# Altium schematic sheet LMP91000 & NO2 Sensor.SchDoc
size A
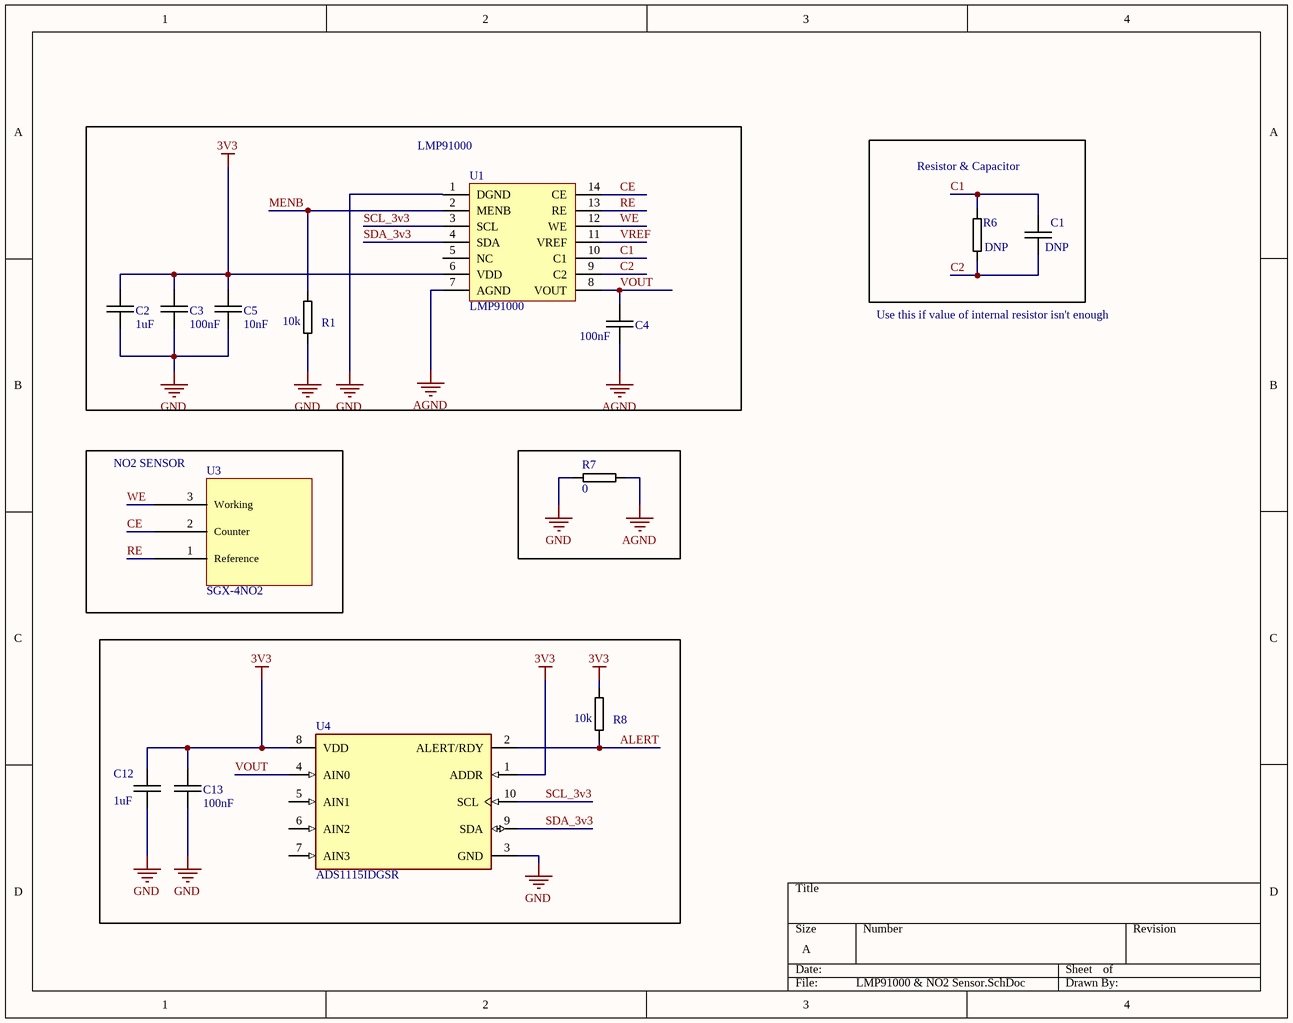
[diagram p0: LMP91000 & NO2 Sensor.SchDoc]

## Parts
C1  DNP  [0603C]
C2  1uF  [0603C]
C3  100nF  [0603C]
C4  100nF  [0603C]
C5  10nF  [0603C]
C12  1uF  [0603C]
C13  100nF  [0603C]
R1  10k  [0603R]
R6  DNP  [0603R]
R7  0  [0603R]
R8  10k  [0603R]
U1  LMP91000  [LMP91000]
U3  SGX-4NO2  [SGX-4NO2]
U4  ADS1115IDGSR  [FP-DGS0010A-MFG]

## Blocks framed on the sheet
LMP91000: C2-C5 R1 U1
Resistor & Capacitor: C1 R6
NO2 SENSOR: U3

## Nets
3V3: C2.1 C3.1 C5.1 C12.2 C13.2 R8.2 U1.6(VDD) U4.1(ADDR) U4.8(VDD)
AGND: C4.1 R7.1 U1.7(AGND)
GND: C2.2 C3.2 C5.2 C12.1 C13.1 R1.1 R7.2 U1.1(DGND) U4.3(GND)
ALERT: R8.1 U4.2(ALERT/RDY)
C1: C1.2 R6.2 U1.10(C1)
C2: C1.1 R6.1 U1.9(C2)
CE: U1.14(CE) U3.2(Counter)
MENB: R1.2 U1.2(MENB)
RE: U1.13(RE) U3.1(Reference)
SCL_3v3: U1.3(SCL) U4.10(SCL)
SDA_3v3: U1.4(SDA) U4.9(SDA)
VOUT: C4.2 U1.8(VOUT) U4.4(AIN0)
VREF: U1.11(VREF)
WE: U1.12(WE) U3.3(Working)

Not connected (* = marked no-connect by the designer): U1 5(NC); U4 5(AIN1) 6(AIN2) 7(AIN3)

## Notes on the sheet
- Use this if value of internal resistor isn't enough

## Library data of the parts
C1-C5 C12 C13 = 0603C
R1 R6-R8 = 0603R
U1 = LMP91000: The LMP91000 is a programmable analog front-end(AFE) for use in micro-power electrochemical sensing applications.
U3 = SGX-4NO2: Amphenol SGX Sensortech SGX-4x Electrochemical Sensors are the industrial and commercial gas sensing products.
U4 = CMP-0003-00385-3: IC ADC 16BIT SIGMA-DELTA 10VSSOP; Max Supply Voltage (DC): 5.5V; Resolution: 16b; Interface: I2C; Number of Inputs: 4; Sampling Rate: 860S/s; Integral Nonlinearity (INL): 1LSB; Min Supply Voltage: 2V; Polarity: Bipolar; Conversion Rate: 0.86KS/s; Supply Type: Single; Number of Converters: 1; Number of Bits: 16; Power Dissipation: 900uW; Case/Package: VSSOP; Contact Plating: Gold; RoHS Compliant: Yes; Max Operating Temperature: 125°C; Lead Free: Lead Free; Package Quantity: 2500; Series: -; Min Supply Voltage (DC): 2V; REACH SVHC: No SVHC; Packaging: Tape and Reel; Max Supply Voltage: 5.5V; Radiation Hardening: No; Min Operating Temperature: -40°C; Number of Pins: 10; Number of A/D Converters: 1